# Altium project posha_loadcell_new.PrjPcb
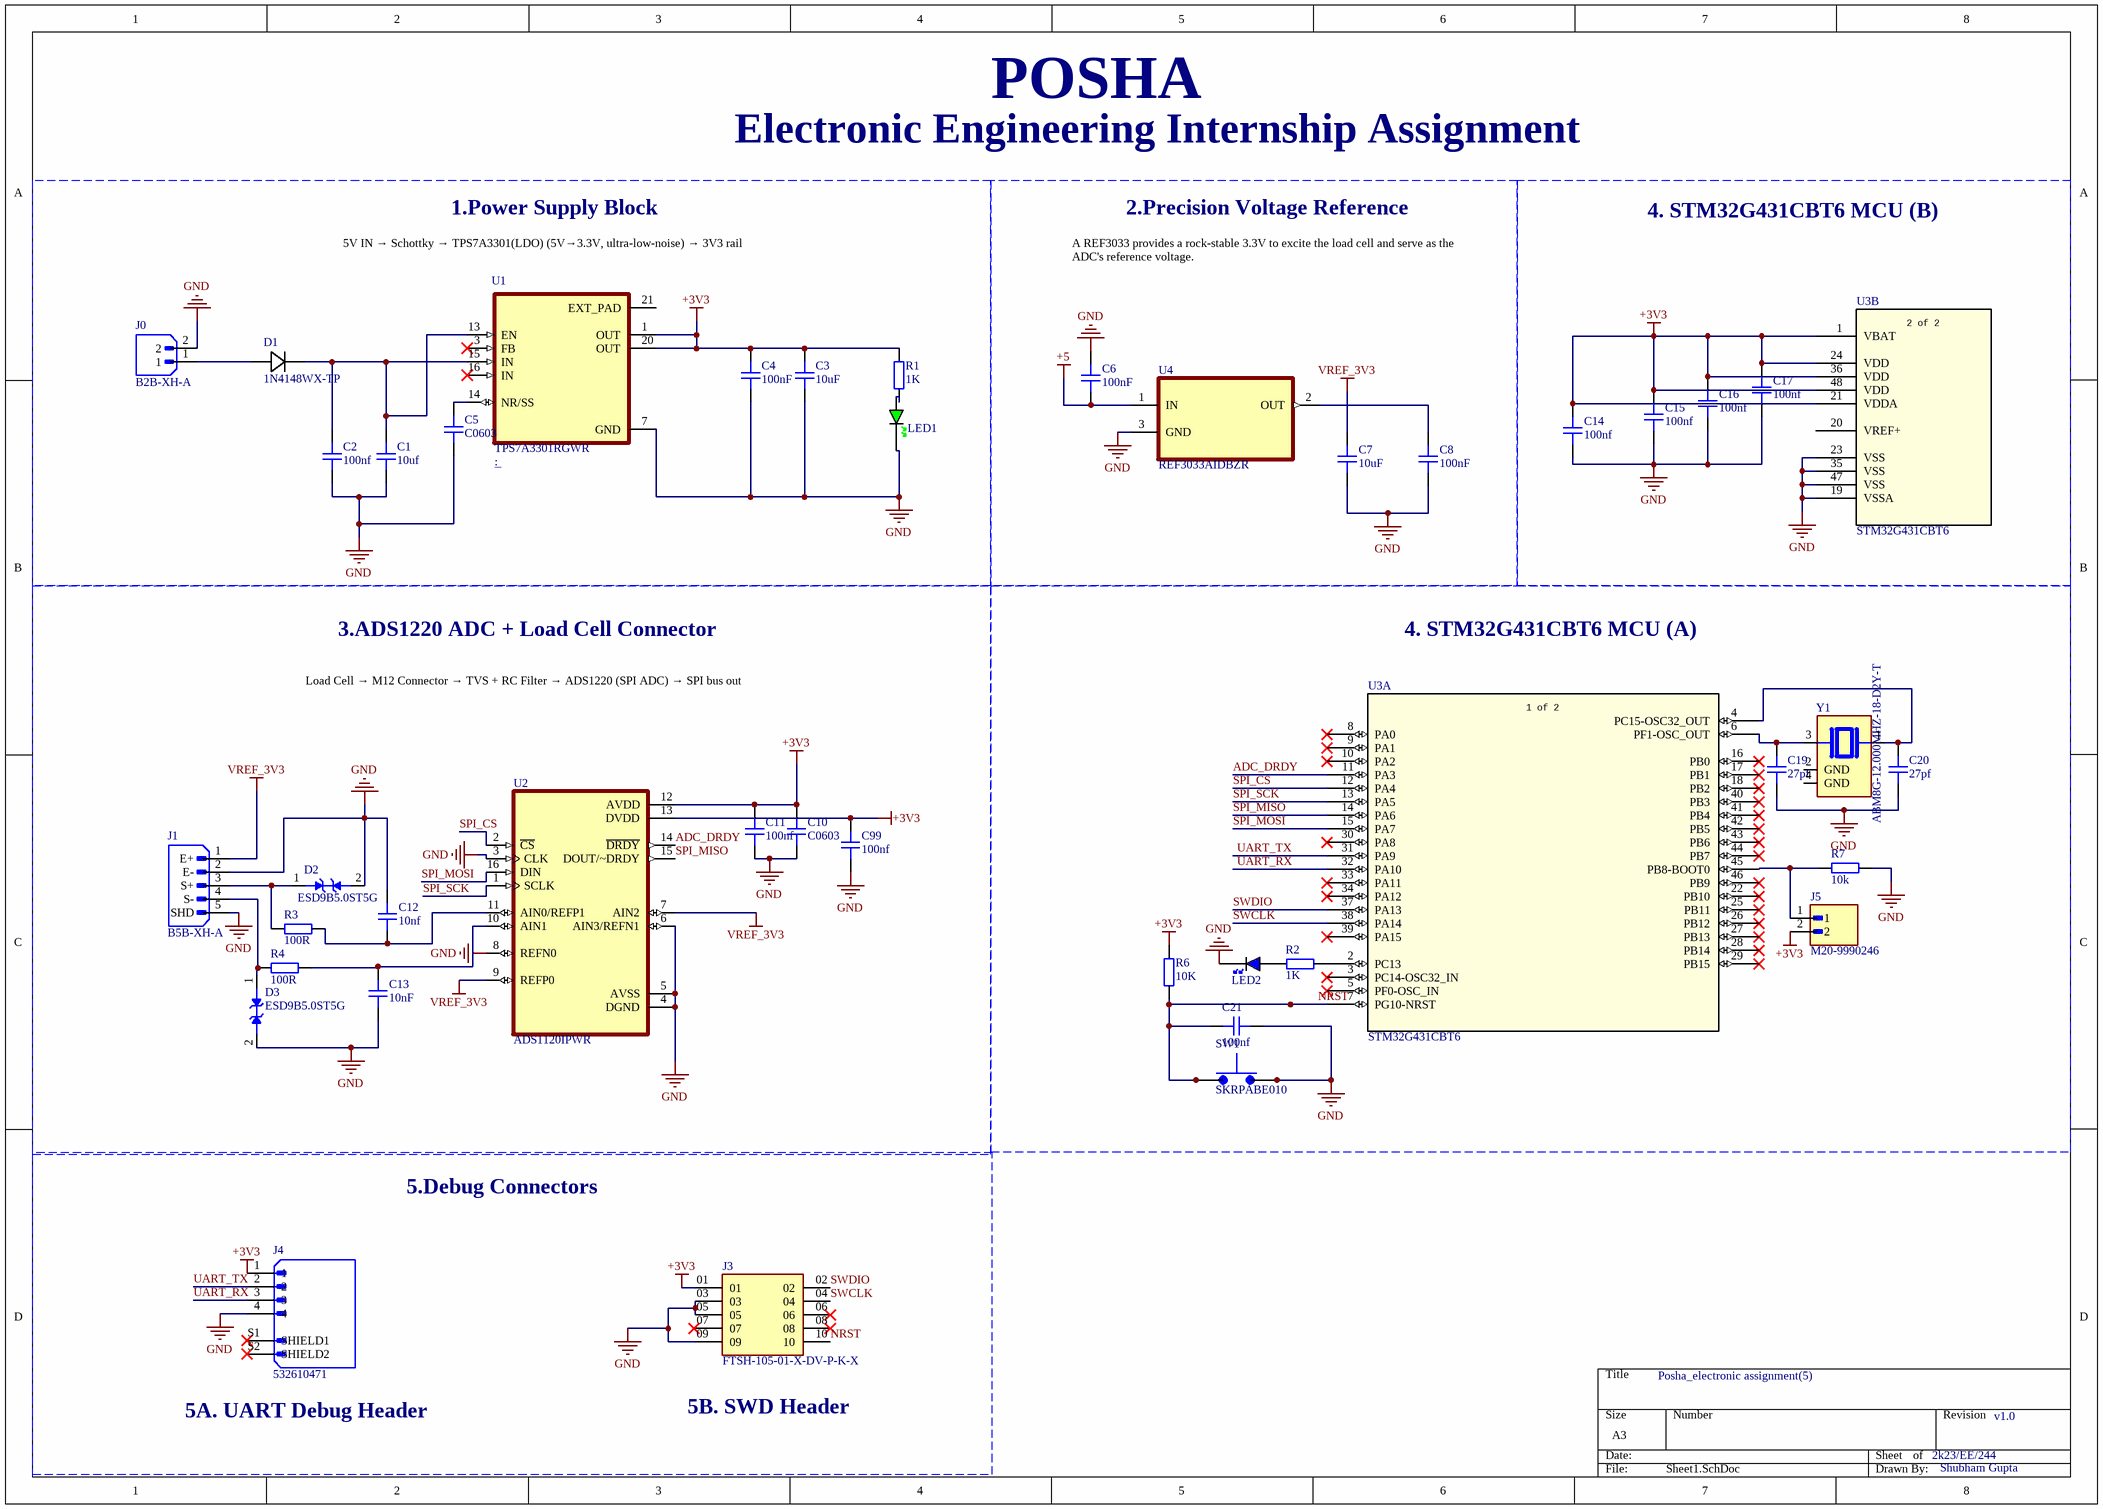
[diagram p0: Sheet1.SchDoc]
1 sheet, 42 parts. Net scope: global (net labels, ports and power ports of the same name join across sheets).
Board file: Posha_4 layers.PcbDoc

## Sheet Sheet1.SchDoc: Posha_electronic assignment(5)
size A3; Date: 29-03-2026; DrawnBy: Shubham Gupta; Organization: Delhi Technological University; SheetNumber: 1; SheetTotal: 1

### Parts
C1  10uf  [CAP_0805]
C2  100nf  [CAP_0603]
C3  10uF  [CAP_0603]
C4  100nF  [CAP_0805]
C5  C0603  [CAP_0603]
C6  100nF  [CAP_0603]
C7  10uF  [CAP_0805]
C8  100nF  [CAP_0603]
C10  C0603  [CAP_0603]
C11  100nf  [CAP_0603]
C12  10nf  [CAP_0603]
C13  10nF  [CAP_0603]
C14  100nf  [CAP_0603]
C15  100nf  [CAP_0603]
C16  100nf  [CAP_0603]
C17  100nf  [CAP_0603]
C19  27pf  [CAP_0603]
C20  27pf  [CAP_0603]
C21  100nf  [CAP_0603]
C99  100nf  [CAP_0603]
D1  1N4148WX-TP  [CR_SOD323_MCC]
D2  ESD9B5.0ST5G  [SODFL1006X40N]
D3  ESD9B5.0ST5G  [SODFL1006X40N]
J0  B2B-XH-A  [HARWIN_M20-9990246]
J1  B5B-XH-A  [JST_B5B-XH-A]
J3  FTSH-105-01-X-DV-P-K-X  [SAMTEC_FTSH-105-01-X-DV-P-K-X]
J4  532610471  [MOLEX_532610471]
J5  M20-9990246  [HARWIN_M20-9990246]
LED1  GREEN  [LED_0603_GREEN]  (value not drawn)
LED2  BLUE  [LED_0402_BLUE]  (value not drawn)
R1  1K  [RES_0603]
R2  1K  [RES_0603]
R3  100R  [RES_0603]
R4  100R  [RES_0603]
R6  10K  [RES_0603]
R7  10k  [RES_0603]
SW1  SKRPABE010  [SW_SKRPABE010]
U1  TPS7A3301RGWR  [QFN65P500X500X100-21N]
U2  ADS1120IPWR  [SOP65P640X120-16N]
U3  STM32G431CBT6  [LQFP48-7x7mm]  (parts A,B of 2)
U4  REF3033AIDBZR  [SOT95P237X112-3N]
Y1  ABM8G-12.000MHZ-18-D2Y-T  [XTAL_ABM8G-12.000MHZ-18-D2Y-T]

### Blocks framed on the sheet
1.Power Supply Block: C1-C5 D1 J0 LED1 R1 U1
2.Precision Voltage Reference: C6-C8 U4
4. STM32G431CBT6 MCU (B): C14-C17 U3
3.ADS1220 ADC + Load Cell Connector: C10-C13 C99 D2 D3 J1 R3 R4 U2
4. STM32G431CBT6 MCU (A): C19-C21 J5 LED2 R2 R6 R7 SW1 U3 Y1

### Nets
+3V3: C3.2 C4.2 C10.2 C11.2 C14.2 C15.2 C16.2 C17.2 C99.2 J3.01 J4.1 J5.2 R1.2 R6.2 U1.1(OUT) U1.20(OUT) U2.12(AVDD) U2.13(DVDD) U3.1(VBAT) U3.21(VDDA) U3.24(VDD) U3.36(VDD) U3.48(VDD)
+5: C6.1 U4.1(IN)
GND: C1.1 C2.1 C3.1 C4.1 C5.1 C6.2 C7.1 C8.1 C10.1 C11.1 C12.2 C13.1 C14.1 C15.1 C16.1 C17.1 C19.2 C20.2 C21.1 C99.1 D2.2(A1) D3.2(A1) J0.2 J1.2(E-) J1.5(SHD) J3.03 J3.05 J3.09 J4.4 LED1.K LED2.K R7.1 SW1.3 SW1.4 U1.7(GND) U2.3(CLK) U2.4(DGND) U2.5(AVSS) U2.6(AIN3/REFN1) U2.8(REFN0) U3.19(VSSA) U3.23(VSS) U3.35(VSS) U3.47(VSS) U4.3(GND)
VREF_3V3: C7.2 J1.1(E+) U2.7(AIN2) U2.9(REFP0)
ADC_DRDY: U2.14(~{DRDY}) U3.11(PA3)
NRST: C21.2 J3.10 R6.1 SW1.1 SW1.2 U3.7(PG10-NRST)
SPI_CS: U2.2(~{CS}) U3.12(PA4)
SPI_MISO: U2.15(DOUT/~DRDY) U3.14(PA6)
SPI_MOSI: U2.16(DIN) U3.15(PA7)
SPI_SCK: U2.1(SCLK) U3.13(PA5)
SWCLK: J3.04 U3.38(PA14)
SWDIO: J3.02 U3.37(PA13)
UART_RX: J4.3 U3.32(PA10)
UART_TX: J4.2 U3.31(PA9)
NetC1_2: C1.2 C2.2 D1.1 U1.13(EN) U1.15(IN)
NetC5_2: C5.2 U1.14(NR/SS)
NetC8_2: C8.2 U4.2(OUT)
NetC12_1: C12.1 R3.1 U2.11(AIN0/REFP1)
NetC13_2: C13.2 R4.1 U2.10(AIN1)
NetC19_1: C19.1 U3.6(PF1-OSC_OUT) Y1.3
NetC20_1: C20.1 U3.4(PC15-OSC32_OUT) Y1.1
NetD1_2: D1.2 J0.1
NetD2_1: D2.1(A) J1.3(S+) R3.2
NetD3_1: D3.1(A) J1.4(S-) R4.2
NetJ5_1: J5.1 R7.2 U3.45(PB8-BOOT0)
NetLED1_A: LED1.A R1.1
NetLED2_A: LED2.A R2.2
NetR2_1: R2.1 U3.2(PC13)

Not connected (* = marked no-connect by the designer): J3 06* 07 08*; J4 S1(SHIELD1)* S2(SHIELD2)*; U1 3(FB)* 16(IN)* 21(EXT_PAD); U3 3(PC14-OSC32_IN)* 5(PF0-OSC_IN)* 8(PA0)* 9(PA1)* 10(PA2)* 16(PB0)* 17(PB1)* 18(PB2)* 20(VREF+) 22(PB10)* 25(PB11)* 26(PB12)* 27(PB13)* 28(PB14)* 29(PB15)* 30(PA8)* 33(PA11)* 34(PA12)* 39(PA15)* 40(PB3)* 41(PB4)* 42(PB5)* 43(PB6)* 44(PB7)* 46(PB9)*; Y1 2(GND) 4(GND)

### Notes on the sheet
- POSHA
- Electronic Engineering Internship Assignment
- (near U1) 5V IN → Schottky → TPS7A3301(LDO) (5V→3.3V, ultra-low-noise) → 3V3 rail
- A REF3033 provides a rock-stable 3.3V to excite the load cell and serve as the ADC's reference voltage.
- Load Cell → M12 Connector → TVS + RC Filter → ADS1220 (SPI ADC) → SPI bus out
- 5.Debug Connectors
- (near J4) 5A. UART Debug Header
- 5B. SWD Header
- 2k23/EE/244
- v1.0
- (in symbol STM32G431CBT6, part A) 1 of 2
- (in symbol STM32G431CBT6, part B) 2 of 2

### Library data of the parts
C1 C4 C7 = CAP_0805: Capacitor SMD 0805; Manufacturer: *; Manufacturer Part Number: *; Distributor Link: *; LCSC: *; Rating: *; Dielectric: *
C2 C3 C5 C6 C8 C10-C17 C19-C21 C99 = CAP_0603: Capacitor SMD 0603; Manufacturer: *; Manufacturer Part Number: *; Distributor Link: *; LCSC: *; Rating: *; Dielectric: *
D1 = 1N4148WX-TP: Description; Manufacturer_Name: MCC; Copyright: Copyright (C) 2025 Ultra Librarian. All rights reserved.; Manufacturer_Part_Number: 1N4148WX-TP
D2 D3 = ESD9B5.0ST5G: Clamp Ipp Tvs Diode Surface Mount SOD-923; MF: ON Semiconductor; Price: None; Availability: Unavailable; Package: SOD-923 ON Semiconductor; SnapEDA_Link: https://www.snapeda.com/parts/ESD9B5.0ST5G/ON%20Semiconductor/view-part/239806/?ref=snap; MP: ESD9B5.0ST5G; Value: *
J0 = B2B-XH-A: MF: {'manufacturer': u'JST Sales America Inc.'}; Package: None; Price: None; Value: *; MP: B2B-XH-A; Availability: Unavailable
J1 = B5B-XH-A: Connector Header Through Hole 5 position 0.098 (2.50mm); MF: JST Sales; SnapEDA_Link: https://www.snapeda.com/parts/B5B-XH-A/JST+Sales+America+Inc./view-part/?ref=snap; Package: None; Value: *; MP: B5B-XH-A; Check_prices: https://www.snapeda.com/parts/B5B-XH-A/JST+Sales+America+Inc./view-part/?ref=eda
J3 = FTSH-105-01-X-DV-P-K-X: MF: {'manufacturer': u'Samtec Inc.'}; Package: None; Price: None; Value: *; MP: FTSH-105-01-X-DV-P-K-X; Availability: Unavailable
J4 = 532610471: Connector Header Surface Mount, Right Angle 4 position 0.049 (1.25mm); MF: Molex; SnapEDA_Link: https://www.snapeda.com/parts/532610471/Molex/view-part/?ref=snap; Price: None; Purchase-URL: https://pricing.snapeda.com/search/part/532610471/?ref=eda; Check_prices: https://www.snapeda.com/parts/532610471/Molex/view-part/?ref=eda; MP: 532610471; Availability: In Stock; Value: *; Package: None
J5 = M20-9990246: 2.54mm (0.1) Pitch SIL Vertical Throughboard Pin Header, 6.1mm mating pin height, tin, 2 contacts; MF: Harwin; SnapEDA_Link: https://www.snapeda.com/parts/M20-9990246/Harwin/view-part/?ref=snap; Package: None; Value: *; MP: M20-9990246; Check_prices: https://www.snapeda.com/parts/M20-9990246/Harwin/view-part/?ref=eda
LED1 = LED_0603_GREEN: LED 0603 GREEN SMD
LED2 = LED_0402_BLUE: LED 0402 BLUE SMD
R1-R4 R6 R7 = RES_0603: Resistor SMD 0603; Manufacturer: *; Manufacturer Part Number: *; Distributor Link: *; LCSC: *
SW1 = SKRPABE010: Switch Tactile N.O. SPST Button J-Bend 0.05A 16VDC 1.57N SMD Automotive T/R; MF: ALPS; SnapEDA_Link: https://www.snapeda.com/parts/SKRPABE010/ALPS/view-part/?ref=snap; Package: None; Value: *; MP: SKRPABE010; Check_prices: https://www.snapeda.com/parts/SKRPABE010/ALPS/view-part/?ref=eda
U1 = TPS7A3301RGWR: 1-A, high-PSRR, negative, adjustable low-dropout voltage regulator with enable 20-VQFN -40 to 125; MF: Texas Instruments; Value: *; Digi-Key_Part_Number: 296-39502-1-ND; Purchase-URL: https://pricing.snapeda.com/search/part/TPS7A3301RGWR/?ref=eda; MP: TPS7A3301RGWR; Package: VQFN-20 Texas Instruments; SnapEDA_Link: https://www.snapeda.com/parts/TPS7A3301RGWR/Texas%20Instruments/view-part/566218/?ref=snap
U2 = ADS1120IPWR: 16-bit, 2-kSPS, 4-ch, low-power, small-size delta-sigma ADC with PGA, VREF, 2x IDACs & SPI interface; MF: Texas Instruments; SnapEDA_Link: https://www.snapeda.com/parts/ADS1120IPWR/Texas+Instruments/view-part/?ref=snap; Package: TSSOP-16 Texas Instruments; Value: *; MP: ADS1120IPWR; Check_prices: https://www.snapeda.com/parts/ADS1120IPWR/Texas+Instruments/view-part/?ref=eda
U3 = STM32G431CBT6: Mainstream Arm Cortex-M4 MCU 170 MHz with 128 Kbytes of Flash memory, Math Accelerator, Medium Analog level integration; Manufacturer_Name: STMicroelectronics; Copyright: Copyright (C) 2025 Ultra Librarian. All rights reserved.; Manufacturer_Part_Number: STM32G431CBT6; RefDes: RefDes; Type: Type
U4 = REF3033AIDBZR: 3.3-V, 50-ppm/Â°C, 50-ÂµA in 3-pin SOT-23 package series (bandgap) voltage reference; MF: Texas Instruments; SnapEDA_Link: https://www.snapeda.com/parts/REF3033AIDBZR/Texas+Instruments/view-part/?ref=snap; Package: SOT-23-3 Texas Instruments; Value: *; MP: REF3033AIDBZR; Check_prices: https://www.snapeda.com/parts/REF3033AIDBZR/Texas+Instruments/view-part/?ref=eda
Y1 = ABM8G-12.000MHZ-18-D2Y-T: 12 MHz Â±20ppm Crystal 18pF 120 Ohms 4-SMD, No Lead; MF: Abracon; Check_prices: https://www.snapeda.com/parts/ABM8G-12.000MHZ-18-D2Y-T/Abracon+LLC/view-part/?ref=eda; Purchase-URL: https://pricing.snapeda.com/search/part/ABM8G-12.000MHZ-18-D2Y-T/?ref=eda; Package: SMD-4 Abracon; SnapEDA_Link: https://www.snapeda.com/parts/ABM8G-12.000MHZ-18-D2Y-T/Abracon+LLC/view-part/?ref=snap; MP: ABM8G-12.000MHZ-18-D2Y-T; Value: *; Digi-Key_Part_Number: 535-10261-2-ND